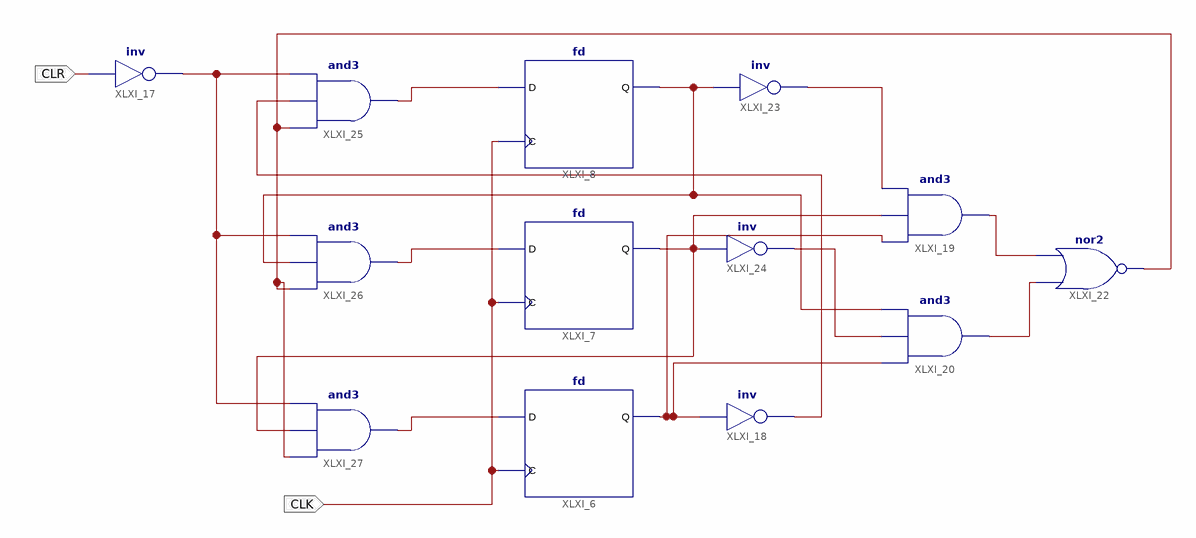
[diagram p0: schematic sheet 1]
// Xilinx ISE schematic C4_29_1.sch (kintex7) as structural Verilog: 13 symbols, 2 ports
module C4_29_1 (
  input  CLK,
  input  CLR
);

  wire XLXN_13, XLXN_15, XLXN_16, XLXN_17, XLXN_18, XLXN_21, XLXN_22, XLXN_23, XLXN_28, XLXN_29, XLXN_30,
       XLXN_31, XLXN_33;

  not XLXI_18 (XLXN_21, XLXN_30);
  not XLXI_17 (XLXN_13, CLR);
  fd XLXI_6 (.C(CLK), .D(XLXN_17), .Q(XLXN_30));
  fd XLXI_7 (.C(CLK), .D(XLXN_16), .Q(XLXN_29));
  fd XLXI_8 (.C(CLK), .D(XLXN_15), .Q(XLXN_18));
  and XLXI_19 (XLXN_22, XLXN_30, XLXN_29, XLXN_28);
  and XLXI_20 (XLXN_23, XLXN_30, XLXN_31, XLXN_18);
  nor XLXI_22 (XLXN_33, XLXN_23, XLXN_22);
  not XLXI_23 (XLXN_28, XLXN_18);
  not XLXI_24 (XLXN_31, XLXN_29);
  and XLXI_25 (XLXN_15, XLXN_33, XLXN_21, XLXN_13);
  and XLXI_26 (XLXN_16, XLXN_33, XLXN_18, XLXN_13);
  and XLXI_27 (XLXN_17, XLXN_33, XLXN_29, XLXN_13);
endmodule
